# EasyEDA Pro project CH32V307_V5.0.0.eprj, board CH32V307
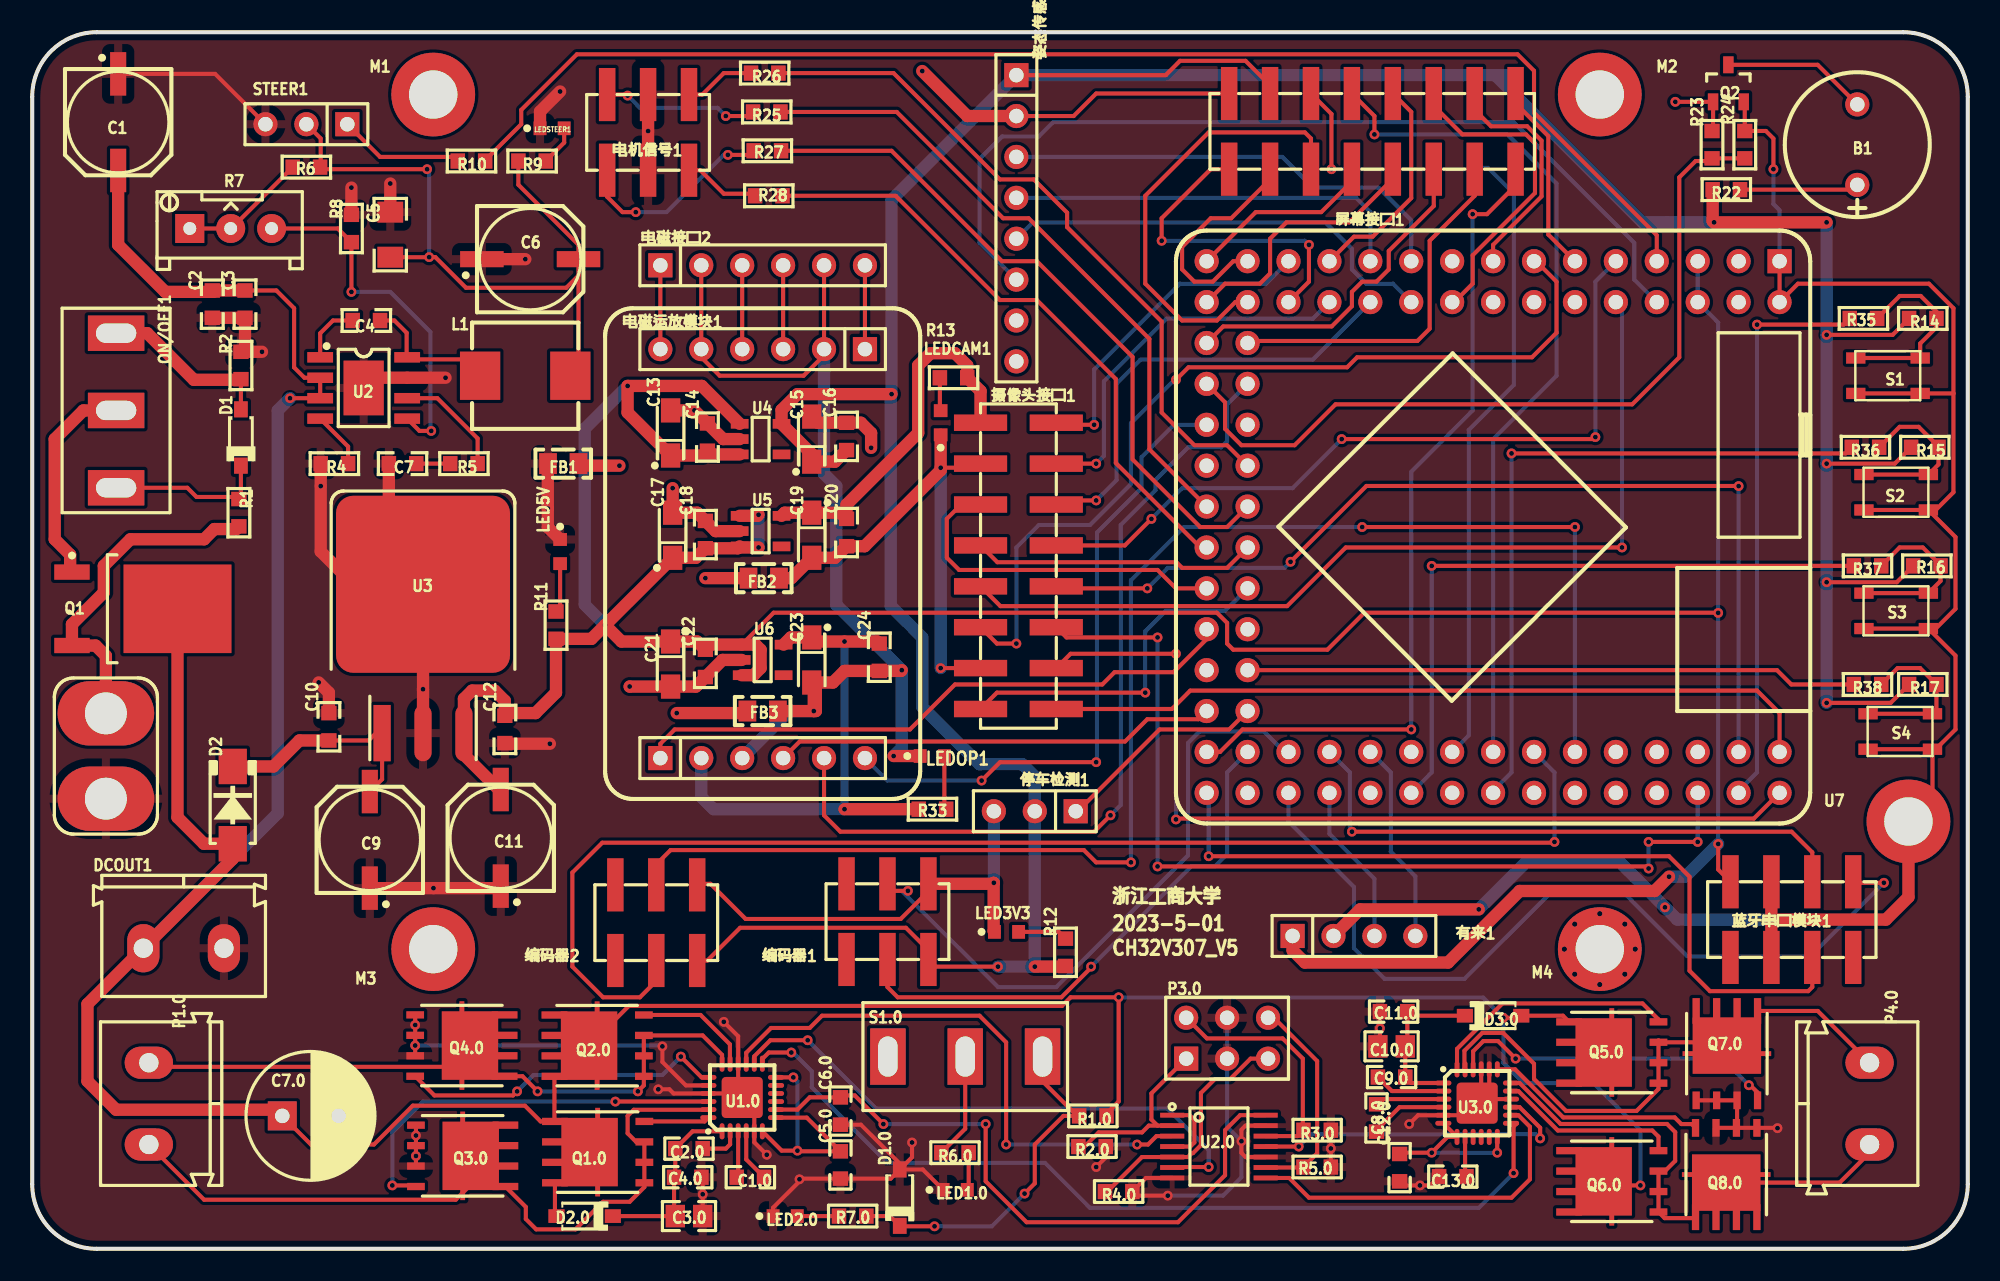
[diagram p1: board, top side]
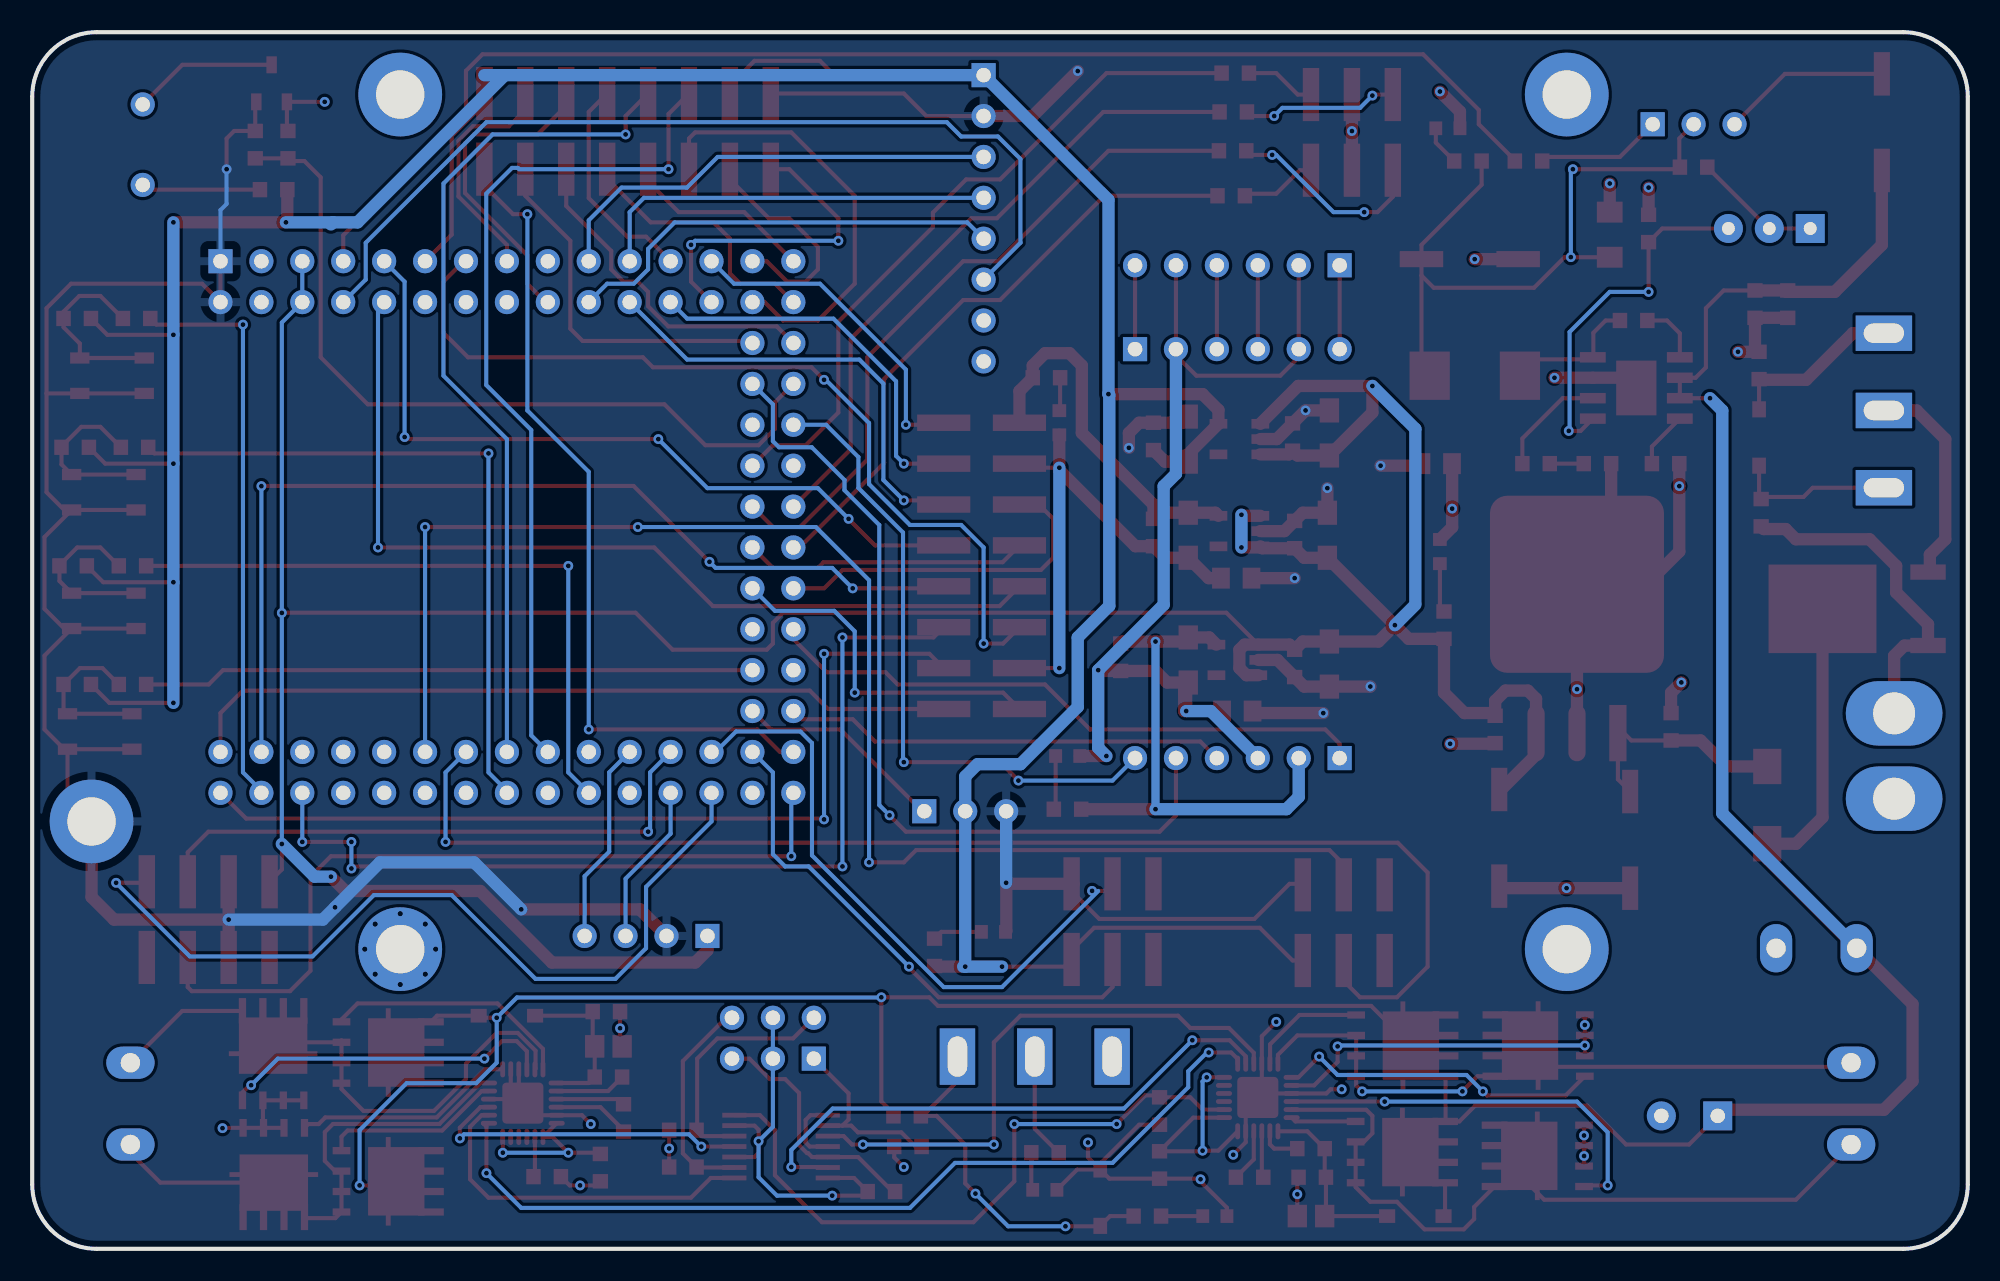
[diagram p2: board, bottom side, seen from below]

Outline 120.14 x 75.56 mm; copper layers: Top Layer, Bottom Layer. Coordinates in mm from the lower left corner of the outline.
Outline path: 0,71.56 0,4 arc(1.17,1.17) 4,0 116.14,0 arc(118.97,1.17) 120.14,4 120.14,71.56 arc(118.97,74.39) 116.14,75.56 4,75.56 arc(1.17,74.39) 0,71.56
Stack: Top Layer 0.035mm / Dielectric1 1.51mm FR4 er 4.5 / Bottom Layer 0.035mm

## Design rules (mm)
spacing safeClearance (default): track to track 0.152, other pairs 0.152 to 0.3
track width trackWidth (default): min 0.127, default 0.254, max 2.54
differential pair differentialPair (default): width min 0.127, default 0.254, max 2.54; gap min 0.152, default 0.152
via viaSize (default): diameter min 0.5, default 0.61, max 10; hole min 0.3, default 0.305, max 6

## Placement (name value [footprint] x y rotation side)
B1  BEEP  [BEEP 9x5.5mm]  113.28 68.58 90 top
C1  220uF  [CAPS6.3]  5.33 69.98 90 top
C1.0  100nF  [CAPC1608[0603]S-N]  44.58 4.44 180 top
C2  4.7nF  [CAPC1608[0603]S-N]  11.18 58.67 270 top
C2.0  1uF  [CAPC1608[0603]S-N]  40.77 6.22 180 top
C3  100nF  [CAPC1608[0603]S-N]  13.21 58.67 270 top
C3.0  10uF  [CAPC2012[0805]S-N]  40.77 2.03 0 top
C4  100nF  [CAPC1608[0603]S-N]  20.74 57.66 0 top
C4.0  100nF  [CAPC1608[0603]S-N]  40.69 4.44 0 top
C5  47uF  [CAPC3216[1206]S]  22.22 62.99 90 top
C5.0  1uF  [CAPC1608[0603]S-N]  50.17 5.21 90 top
C6  220uF  [CAPS6.3]  30.91 61.47 180 top
C6.0  1uF  [CAPC1608[0603]S-N]  50.17 8.56 90 top
C7  4.7nF  [CAPC1608[0603]S-N]  22.99 48.77 180 top
C7.0  220uF  [CAPPR3.5-8X11.5]  17.27 8.25 0 top
C8.0  100nF  [CAPC1608[0603]S-N]  83.44 8.13 90 top
C9  100uF  [CAPS6.3]  20.95 25.4 270 top
C9.0  1uF  [CAPC1608[0603]S-N]  84.38 10.67 0 top
C10  100nF  [CAPC1608[0603]S-N]  18.41 32.42 90 top
C10.0  10uF  [CAPC2012[0805]S-N]  84.38 12.57 180 top
C11  220uF  [CAPS6.3]  29.08 25.53 270 top
C11.0  100nF  [CAPC1608[0603]S-N]  84.5 14.73 180 top
C12  100nF  [CAPC1608[0603]S-N]  29.34 32.26 270 top
C12.0  1uF  [CAPC1608[0603]S-N]  84.87 5.04 90 top
C13  10uF  [CAPT3216]  39.62 50.67 90 top
C13.0  1uF  [CAPC1608[0603]S-N]  88.18 4.48 0 top
C14  100nF  [CAPC1608[0603]S-N]  41.91 50.42 90 top
C15  10uF  [CAPT3216]  48.39 50.29 90 top
C16  100nF  [CAPC1608[0603]S-N]  50.55 50.46 90 top
C17  10uF  [CAPT3216]  39.75 44.32 90 top
C18  100nF  [CAPC1608[0603]S-N]  41.78 44.36 90 top
C19  10uF  [CAPT3216]  48.39 44.32 270 top
C20  100nF  [CAPC1608[0603]S-N]  50.55 44.49 270 top
C21  10uF  [CAPT3216]  39.62 36.32 270 top
C22  100nF  [CAPC1608[0603]S-N]  41.78 36.36 270 top
C23  10uF  [CAPT3216]  48.39 36.57 270 top
C24  100nF  [CAPC1608[0603]S-N]  52.58 36.74 270 top
D1  BZT52C16  [SOD-123-L]  12.95 50.39 270 top
D1.0  BZT52C3V3  [SOD-123-L]  53.85 3.18 270 top
D2  SS54  [SMA[DO-214AC]]  12.45 27.56 90 top
D2.0  1N5819  [SOD-123-L]  34.29 2.03 0 top
D3.0  1N5819  [SOD-123-L]  90.68 14.48 180 top
DCOUT1  KF/WJ/DG 30x connecter  [KF/WJ/DG 301-2p-5.0mm#2]  9.4 18.67 0 top
FB1  0R  [INDC2012[0805]S]  32.96 48.77 0 top
FB2  0R  [INDC2012[0805]S]  45.41 41.66 0 top
FB3  0R  [INDC2012[0805]S]  45.34 33.4 0 top
L1  4.7uH  [0630 TPC 7*7*3]  30.6 54.23 0 top
LED1.0  Blue  [LEDC1608(0603)]  57.29 3.66 0 top
LED2.0  RED  [LEDC1608(0603)]  46.74 2.03 0 top
LED3V3  翠绿贴片LED  [LEDC1608(0603)]  60.48 19.69 0 top
LED5V  翠绿贴片LED  [LEDC1608(0603)]  32.77 43.31 270 top
LEDCAM1  翠绿贴片LED  [LEDC1608(0603)]  56.39 51.31 90 top
LEDOP1  翠绿贴片LED  [LEDC1608(0603)]  55.87 30.61 0 top
LEDSTEER1  翠绿贴片LED  [LEDC1608(0603)]  32.27 69.6 0 top
M1  MountHole  [M3-MountHole-Plated]  24.89 71.69 0 top
M2  MountHole  [M3-MountHole-Plated]  97.3 71.69 0 top
M3  MountHole  [M3-MountHole-Plated]  24.89 18.61 0 top
M4  MountHole  [M3-MountHole-Plated]  97.3 18.61 0 top
NOREF  -  [Pad_e1205]  116.46 26.54 0 top
ON/OFF1  SW-SPDT  [SS12D10]  5.21 52.07 90 top
P1.0  KF/WJ/DG 30x connecter  [KF/WJ/DG 301-2p-5.0mm]  7.24 9.02 270 top
P3.0  Header 3X2  [HDR2X3]  71.63 11.81 0 top
P4.0  KF/WJ/DG 30x connecter  [KF/WJ/DG 301-2p-5.0mm]  114.05 9.02 90 top
Q1  HY19P03  [TO-252AA]  5.74 39.75 0 top
Q1.0  TPH1R403NL  [DFN5x6]  35.1 6.01 90 top
Q2  S8050  [SOT-23]  105.28 72.39 90 top
Q2.0  TPH1R403NL  [DFN5x6]  35.06 12.62 90 top
Q3.0  TPH1R403NL  [DFN5x6]  26.72 5.77 270 top
Q4.0  TPH1R403NL  [DFN5x6]  26.67 12.62 270 top
Q5.0  TPH1R403NL  [DFN5x6]  98.04 12.19 90 top
Q6.0  TPH1R403NL  [DFN5x6]  98.04 4.19 90 top
Q7.0  TPH1R403NL  [DFN5x6]  105.19 12.12 0 top
Q8.0  TPH1R403NL  [DFN5x6]  105.15 4.61 180 top
R1  4.7K  [RESC1608[0603]S-N]  12.83 45.72 90 top
R1.0  2.2K  [RESC1608[0603]S-N]  65.83 8.25 180 top
R2  1K  [RESC1608[0603]S-N]  12.95 54.86 270 top
R2.0  10K  [RESC1608[0603]S-N]  65.79 6.35 0 top
R3.0  10K  [RESC1608[0603]S-N]  79.76 7.37 180 top
R4  200K  [RESC1608[0603]S-N]  18.76 48.77 180 top
R4.0  10K  [RESC1608[0603]S-N]  67.44 3.56 0 top
R5  20K  [RESC1608[0603]S-N]  26.8 48.77 180 top
R5.0  10K  [RESC1608[0603]S-N]  79.76 5.08 180 top
R6  15K  [RESC1608[0603]S-N]  17.02 67.18 180 top
R6.0  330R  [RESC1608[0603]S-N]  57.28 5.97 0 top
R7  10K  [RESPOT3296]  12.32 63.37 0 top
R7.0  1K  [RESC1608[0603]S-N]  50.93 2.03 180 top
R8  3.3K  [RESC1608[0603]S-N]  19.81 63.37 90 top
R9  10K  [RESC1608[0603]S-N]  31.03 67.56 180 top
R10  1K  [RESC1608[0603]S-N]  27.27 67.56 0 top
R11  4.7K  [RESC1608[0603]S-N]  32.51 38.73 90 top
R12  2.7K  [RESC1608[0603]S-N]  64.14 18.41 90 top
R13  2.7K  [RESC1608[0603]S-N]  57.19 54.1 180 top
R14  4.7K(DNP)  [RESC1608[0603]S-N]  117.35 57.78 0 top
R15  4.7K(DNP)  [RESC1608[0603]S-N]  117.48 49.78 0 top
R16  4.7K(DNP)  [RESC1608[0603]S-N]  117.6 42.42 0 top
R17  4.7K(DNP)  [RESC1608[0603]S-N]  117.35 35.05 0 top
R22  10R  [RESC1608[0603]S-N]  105.16 65.79 0 top
R23  4.7K  [RESC1608[0603]S-N]  104.27 68.58 90 top
R24  10K  [RESC1608[0603]S-N]  106.3 68.58 90 top
R25  100R  [RESC1608[0603]S-N]  45.59 70.61 0 top
R26  100R  [RESC1608[0603]S-N]  45.47 73.02 0 top
R27  100R  [RESC1608[0603]S-N]  45.63 68.2 0 top
R28  100R  [RESC1608[0603]S-N]  45.72 65.41 0 top
R33  2.7K  [RESC1608[0603]S-N]  55.88 27.3 0 top
R35  470R  [RESC1608[0603]S-N]  113.67 57.78 180 top
R36  470R  [RESC1608[0603]S-N]  113.79 49.78 180 top
R37  470R  [RESC1608[0603]S-N]  113.92 42.42 180 top
R38  470R  [RESC1608[0603]S-N]  113.92 35.05 180 top
S1  Button  [PTS810-3*4-CurvePin]  115.19 54.23 0 top
S1.0  SW-SPDT  [SS12D10]  57.91 11.94 0 top
S2  Button  [PTS810-3*4-CurvePin]  115.7 46.99 0 top
S3  Button  [PTS810-3*4-CurvePin]  115.7 39.62 0 top
S4  Button  [PTS810-3*4-CurvePin]  115.95 32.13 0 top
STEER1  Header 3  [HDR1X3]  19.56 69.85 180 top
U1  T型插头  [Wired T-Header ThroughHole]  4.57 30.61 0 top
U1.0  DRV8701E  [QFN24-4x4]  44.07 9.4 90 top
U2  SCT2450  [SOP-8E]  20.57 53.47 0 top
U2.0  SN74HC125PWR  [TSSOP-14]  73.66 6.35 0 top
U3  SPX2940-5.0  [TO-263-3]  24.26 36.65 0 top
U3.0  DRV8701E  [QFN24-4x4]  89.69 9.05 0 top
U4  RT9013-33  [SOT-23-5]  45.21 50.29 0 top
U5  RT9013-33  [SOT-23-5]  45.21 44.58 0 top
U6  RT9013-33  [SOT-23-5]  45.34 36.58 0 top
U7  -  [CH32V307VxT6_CoreBoard]  108.46 61.34 180 top
停车检测1  Header 3  [HDR1X3]  64.77 27.18 180 top
姿态传感器1  Header 8  [HDR1X8]  61.09 72.9 270 top
屏幕接口1  Header 8X2  [HDR2X8-M-SMT]  83.18 69.41 0 top
摄像头接口1  Header 8X2  [HDR2X8-M-SMT]  61.21 42.42 90 top
有来1  Header 4  [HDR1X4]  78.23 19.43 0 top
电机信号1  Header 3X2  [HDR2X3-M-SMT]  38.23 69.34 180 top
电磁接口2  Header 6  [HDR1X6]  38.99 61.09 0 top
电磁运放模块1  OPA_MOD  [SEEKFREE_4CHANEL_OPAMOD]  45.34 43.18 0 top
编码器1  Header 3X2  [HDR2X3-M-SMT]  53.09 20.32 180 top
编码器2  Header 3X2  [HDR2X3-M-SMT]  38.73 20.26 180 top
蓝牙串口模块1  Header 4X2  [Female-Header-2.54-SMD-8]  109.22 20.45 270 top

## Footprints (pads in the part's own frame, mm; a bottom-side part is the same pattern mirrored in y, then rotated)
0630 TPC 7*7*3
  rect 2.5x3 smd: 1(-2.8,0) 2(2.8,0)
BEEP 9x5.5mm
  round 1.5 hole 0.9: 1(-2.5,0) 2(2.5,0)
CAPC1608[0603]S-N
  rect 0.9x0.95 smd: 1(-0.85,0) 2(0.85,0)
CAPC2012[0805]S-N
  rect 1.2x1.4 smd: 1(-0.85,0) 2(0.85,0)
CAPC3216[1206]S
  rect 1.3x1.6 smd: 1(-1.4,0) 2(1.4,0)
CAPPR3.5-8X11.5
  rect 1.8x1.8 hole 0.9: 1(-1.75,0)
  round 1.8 hole 0.9: 2(1.75,0)
CAPS6.3
  rect 2.7x1 smd: 1(-3,0) 2(3,0)
CAPT3216
  rect 1.5x1.2 smd: 1(-1.4,0) 2(1.4,0)
CH32V307VxT6_CoreBoard
  rect 1.5x1.5 hole 0.9: 1(0,0)
  round 1.5 hole 0.9: 2(0,2.54) 3(2.54,0) 4(2.54,2.54) 5(5.08,0) 6(5.08,2.54) 7(7.62,0) 8(7.62,2.54) 9(10.16,0) 10(10.16,2.54) 11(12.7,0) 12(12.7,2.54) 13(15.24,0) 14(15.24,2.54) 15(17.78,0) 16(17.78,2.54) 17(20.32,0) 18(20.32,2.54) 19(22.86,0) 20(22.86,2.54) 21(25.4,0) 22(25.4,2.54) 23(27.94,0) 24(27.94,2.54) 25(30.48,0) 26(30.48,2.54) 27(33.02,0) 28(33.02,2.54) 29(35.56,0) 30(35.56,2.54) 31(35.56,5.08) 32(33.02,5.08) 33(35.56,7.62) 34(33.02,7.62) 35(35.56,10.16) 36(33.02,10.16) 37(35.56,12.7) 38(33.02,12.7) 39(35.56,15.24) 40(33.02,15.24) 41(35.56,17.78) 42(33.02,17.78) 43(35.56,20.32) 44(33.02,20.32) 45(35.56,22.86) 46(33.02,22.86) 47(35.56,25.4) 48(33.02,25.4) 49(35.56,27.94) 50(33.02,27.94) 51(35.56,33.02) 52(35.56,30.48) 53(33.02,33.02) 54(33.02,30.48) 55(30.48,33.02) 56(30.48,30.48) 57(27.94,33.02) 58(27.94,30.48) 59(25.4,33.02) 60(25.4,30.48) 61(22.86,33.02) 62(22.86,30.48) 63(20.32,33.02) 64(20.32,30.48) 65(17.78,33.02) 66(17.78,30.48) 67(15.24,33.02) 68(15.24,30.48) 69(12.7,33.02) 70(12.7,30.48) 71(10.16,33.02) 72(10.16,30.48) 73(7.62,33.02) 74(7.62,30.48) 75(5.08,33.02) 76(5.08,30.48) 77(2.54,33.02) 78(2.54,30.48) 79(0,33.02) 80(0,30.48)
DFN5x6
  rect 0.45x1.6 smd: 1(-1.905,2.65) 1(-0.635,2.65) 1(0.635,2.65) 1(1.905,2.65)
  rect 4.25x3.5 smd: 1(0,0.5)
  rect 5.5x0.3 smd: 1(0,0)
  rect 0.45x1.1 smd: 2(1.905,-2.9) 3(-1.905,-2.9) 3(-0.635,-2.9) 3(0.635,-2.9)
Female-Header-2.54-SMD-8
  rect 3.3x1.02 smd: 1(-2.35,3.81) 2(2.35,3.81) 3(-2.35,1.27) 4(2.35,1.27) 5(-2.35,-1.27) 6(2.35,-1.27) 7(-2.35,-3.81) 8(2.35,-3.81)
HDR1X3
  rect 1.5x1.5 hole 0.9: 1(0,0)
  round 1.5 hole 0.9: 2(2.54,0) 3(5.08,0)
HDR1X4
  rect 1.5x1.5 hole 0.9: 1(0,0)
  round 1.5 hole 0.9: 2(2.54,0) 3(5.08,0) 4(7.62,0)
HDR1X6
  rect 1.5x1.5 hole 0.9: 1(0,0)
  round 1.5 hole 0.9: 2(2.54,0) 3(5.08,0) 4(7.62,0) 5(10.16,0) 6(12.7,0)
HDR1X8
  rect 1.5x1.5 hole 0.9: 1(0,0)
  round 1.5 hole 0.9: 2(2.54,0) 3(5.08,0) 4(7.62,0) 5(10.16,0) 6(12.7,0) 7(15.24,0) 8(17.78,0)
HDR2X3
  rect 1.5x1.5 hole 0.9: 1(0,0)
  round 1.5 hole 0.9: 2(0,2.54) 3(2.54,0) 4(2.54,2.54) 5(5.08,0) 6(5.08,2.54)
HDR2X3-M-SMT
  rect 1.02x3.3 smd: 1(-2.54,-2.35) 2(-2.54,2.35) 3(0,-2.35) 4(0,2.35) 5(2.54,-2.35) 6(2.54,2.35)
HDR2X8-M-SMT
  rect 1.02x3.3 smd: 1(-8.89,-2.35) 2(-8.89,2.35) 3(-6.35,-2.35) 4(-6.35,2.35) 5(-3.81,-2.35) 6(-3.81,2.35) 7(-1.27,-2.35) 8(-1.27,2.35) 9(1.27,-2.35) 10(1.27,2.35) 11(3.81,-2.35) 12(3.81,2.35) 13(6.35,-2.35) 14(6.35,2.35) 15(8.89,-2.35) 16(8.89,2.35)
INDC2012[0805]S
  rect 1.1x1.3 smd: 1(-0.948,0) 2(0.948,0)
KF/WJ/DG 301-2p-5.0mm
  oval 2x3 hole 1.2: 1(2.54,0) 2(-2.54,0)
KF/WJ/DG 301-2p-5.0mm#2
  oval 2x3 hole 1.2: 1(2.5,0) 2(-2.5,0)
LEDC1608(0603)
  rect 0.8x0.85 smd: A(0.75,0) C(-0.75,0)
M3-MountHole-Plated
  round 5.2 hole 3: 1(0,0)
Pad_e1205
  round 5.2 hole 3: 1(0,0)
PTS810-3*4-CurvePin
  rect 1.2x0.7 smd: 1(-2,-1.1) 1(2,-1.1) 2(-2,1.1) 2(2,1.1)
QFN24-4x4
  rrect 2.55x2.55 smd: 0(0,0)
  oval 1x0.3 smd: 1(-2.1,1.25) 2(-2.1,0.75) 3(-2.1,0.25) 4(-2.1,-0.25) 5(-2.1,-0.75) 6(-2.1,-1.25) 13(2.1,-1.25) 14(2.1,-0.75) 15(2.1,-0.25) 16(2.1,0.25) 17(2.1,0.75) 18(2.1,1.25)
  oval 0.3x1 smd: 7(-1.25,-2.1) 8(-0.75,-2.1) 9(-0.25,-2.1) 10(0.25,-2.1) 11(0.75,-2.1) 12(1.25,-2.1) 19(1.25,2.1) 20(0.75,2.1) 21(0.25,2.1) 22(-0.25,2.1) 23(-0.75,2.1) 24(-1.25,2.1)
RESC1608[0603]S-N
  rect 0.9x0.95 smd: 1(-0.85,0) 2(0.85,0)
RESPOT3296
  rect 1.8x1.8 hole 0.8: 1(-2.54,0)
  round 1.8 hole 0.8: 2(2.54,0) ADJ(0,0)
SEEKFREE_4CHANEL_OPAMOD
  rect 1.5x1.5 hole 0.9: 1(6.35,12.7) 7(-6.35,-12.7)
  round 1.5 hole 0.9: 2(3.81,12.7) 3(1.27,12.7) 4(-1.27,12.7) 5(-3.81,12.7) 6(-6.35,12.7) 8(-3.81,-12.7) 9(-1.27,-12.7) 10(1.27,-12.7) 11(3.81,-12.7) 12(6.35,-12.7)
SMA[DO-214AC]
  rect 2.2x1.75 smd: A(-2.4,0) K(2.4,0)
SOD-123-L
  rect 1x0.85 smd: A(-1.75,0) K(1.75,0)
SOP-8E
  rect 2.5x3.4 smd: 0(0,0)
  rect 1.6x0.65 smd: 1(-2.7,1.905) 2(-2.7,0.635) 3(-2.7,-0.635) 4(-2.7,-1.905) 5(2.7,-1.905) 6(2.7,-0.635) 7(2.7,0.635) 8(2.7,1.905)
SOT-23
  rect 1.05x0.65 smd: 1(-1.15,0.95) 2(-1.15,-0.95) 3(1.15,0)
SOT-23-5
  rect 1.1x0.6 smd: 1(-1.3,0.95) 2(-1.3,0) 3(-1.3,-0.95) 4(1.3,-0.95) 5(1.3,0.95)
SS12D10
  rect 2.2x3.5 hole 1.2x2.5: 1(-4.8,0) 2(0,0) 3(4.8,0)
TO-252AA
  rect 6.7x5.5 smd: 1(3.275,0)
  rect 2.2x0.95 smd: 2(-3.275,2.28) 3(-3.275,-2.28)
TO-263-3
  rect 1.07x3.5 smd: 1(-2.54,-4.623)
  rrect 10.8x11 smd: 2(0,4.623)
  rrect 1.07x3.5 smd: 2(0,-4.623) 3(2.54,-4.623)
TSSOP-14
  rect 1.5x0.3 smd: 1(-2.9,1.95) 2(-2.9,1.3) 3(-2.9,0.65) 4(-2.9,0) 5(-2.9,-0.65) 6(-2.9,-1.3) 7(-2.9,-1.95) 8(2.9,-1.95) 9(2.9,-1.3) 10(2.9,-0.65) 11(2.9,0) 12(2.9,0.65) 13(2.9,1.3) 14(2.9,1.95)
Wired T-Header ThroughHole
  rrect 6x4 hole 2.6: 1(0,2.65) 2(0,-2.65)

## Nets
As in the schematic, except:
GND5V: C13.2 C14.2 C15.2 C16.2 C17.2 C18.2 C21.2 C22.2 FB1.2 FB2.1 FB3.1 LED3V3.C NOREF.1 Q2.2 R24.2 S1.1 S2.1 S3.1 S4.1 U4.2 U5.2 U6.2 U7.1 U7.2 停车检测1.3 姿态传感器1.2 屏幕接口1.2 有来1.2 编码器1.1 编码器2.1 蓝牙串口模块1.5 蓝牙串口模块1.6

Pads without a net: M1 1; M2 1; M3 1; M4 1; S1.0 1; U1.0 9 10 11; U3.0 9 10 11; U4 4; U5 4; U6 4; U7 3 4 12 14 16 17 36 37 46 47 53 59 62 63 67 69 71 72 73 74 76; 姿态传感器1 7 8; 编码器1 5 6; 编码器2 5 6; 蓝牙串口模块1 2 8

## Via types
v1: diameter 0.61, hole 0.305, Top Layer to Bottom Layer, 162 vias

## Routing (per net, layer and track width the routed paths; a pad name or vN(x,y) marks a point on that pad's centre or on a via; arc(x,y) is an arc through that point)
3V3: length 22.2
  Top Layer w0.254: R1.0.2 64.86,8.25 ; 64.86,8.25 62.71,10.4 S1.0.3 ; 64.86,8.25 64.01,8.25 62.23,6.48 62.23,4.06 v1(61.59,3.43) ; v1(56.01,1.4) 53.88,1.4 D1.0.K 53.24,2.03 51.83,2.03
  Bottom Layer w0.254: v1(61.59,3.43) 59.56,1.4 v1(56.01,1.4)
DVDD: length 40.5
  Top Layer w0.254: 49.88,9.41 48.26,9.41 47.5,8.65 U1.0.8 ; 49.88,9.41 C6.0.2 50.28,9.53 51.05,9.53 v1(52.83,7.75) ; 49.88,9.41 49.89,9.4 ; U2.0.14 74.98,8.3 74.04,7.37 74.04,4.57 71.12,1.65 61.72,1.65 59.18,4.19 v1(59.18,7.75)
  Bottom Layer w0.254: v1(59.18,7.75) v1(52.83,7.75)
GND5V: length 212.1
  Top Layer w0.254: Q2.2 106.3,71.17 R24.2 107.61,69.43 108.08,68.96 v1(108.08,67.06) ; S3.1 S3.1 ; S3.1 119.38,36.84 119.38,32.26 118.15,31.03 S4.1 ; S3.1 118.15,38.52 119.38,39.75 119.38,44.21 S2.1 ; 119.25,53.13 119.25,58.42 117.73,59.94 109.6,59.94 U7.2 U7.1 ; 119.25,53.13 119.25,46.99 118.15,45.89 S2.1 ; 119.25,53.13 S1.1 S1.1 ; S2.1 S2.1 ; S4.1 S4.1 ; S4.1 117.95,28.03 NOREF.1 ; 编码器1.1 55.63,22.21 53.91,20.49 44.28,20.49 42.1,22.67 41.34,22.67 编码器2.1 ; 屏幕接口1.2 66.04,71.76 64.64,70.36 姿态传感器1.2
  Top Layer w0.762: 蓝牙串口模块1.6 v1(107.95,20.45) ; v1(107.95,20.45) 115.06,20.45 116.46,21.84 NOREF.1 ; v1(107.95,20.45) 蓝牙串口模块1.5 ; 44.04,36.58 42.85,36.58 C22.2 41.19,34.92 C21.2 37.09,34.92 v1(37.08,34.92) ; v1(52.07,49.75) 52.07,50.67 51.43,51.31 C16.2 48.77,51.31 48.39,51.69 ; v1(55.24,73.15) 58.04,70.36 姿态传感器1.2 ; 39.62,52.07 v1(41.11,52.07) C14.2 42.89,50.29 U4.2 ; v1(41.78,41.66) FB2.1 ; v1(36.45,48.64) 34.04,48.64 33.91,48.77 ; v1(89.79,21.08) 82.42,21.08 有来1.2 ; 55.5,22.67 编码器1.1 59.63,22.67 59.68,22.72 ; 59.68,22.72 59.68,19.73 LED3V3.C ; 59.68,22.72 v1(59.69,22.73) ; v1(40,33.27) 44.26,33.27 FB3.1 ; v1(39.75,47.24) C17.2 41.27,45.72 C18.2 42.42,44.58 U5.2
  Bottom Layer w0.254: U7.1 108.46,64.52 108.08,64.9 v1(108.08,67.06)
  Bottom Layer w0.762: v1(59.69,22.73) 停车检测1.3 ; v1(89.79,21.08) 92.71,24 98.55,24 v1(101.35,21.21) 102.11,20.45 v1(107.95,20.45)
GNDBAT: length 196.7
  Top Layer w0.254: U2.0.13 75.31,7.65 75.06,7.4 v1(75.06,6.68) 75.06,5.95 75.31,5.7 U2.0.10 ; v1(45.59,5.84) 44.82,6.62 U1.0.5 44.82,8.65 43.82,9.65 ; v1(38.86,9.91) 39.55,9.91 39.81,9.65 43.82,9.65 ; LED1.0.C 55.28,4.93 D1.0.A ; 108.33,7.51 Q8.0.3 Q8.0.3 ; 66.64,6.07 66.64,5.68 v1(66.04,5.08) ; 43.82,9.65 U1.0.16 43.82,13.2 v1(42.93,14.1) ; v1(70.48,3.3) 68.54,3.3 R4.0.2 69.13,4.4 U2.0.7 ; v1(54.61,6.6) 54.61,5.69 D1.0.A ; C1.2 11.35,72.98 STEER1.3 ; C11.0.2 v1(83.65,13.7) 83.65,12.7 83.78,12.57 ; v1(23.77,12.63) Q4.0.3 ; 23.77,13.39 23.77,12.88 ; 105.82,9.09 105.82,7.55 Q8.0.3 ; Q3.0.3 v1(23.82,7.04) Q3.0.3 v1(23.82,5.76) Q3.0.3 ; R3.0.1 v1(80.61,6.23) R5.0.1 ; v1(39.12,12.57) 39.12,11.6 40.57,10.15 41.97,10.15 ; C6.0.1 51.43,7.71 53.85,5.29 D1.0.A ; Q7.0.3 Q7.0.3 Q7.0.3 ; D1.0.A 53.28,4.36 C5.0.1 47.66,4.36 v1(47.62,4.32) 47.62,4.19 45.99,2.55 LED2.0.C ; Q8.0.3 Q8.0.3 ; 89.94,9.3 U3.0.0 88.94,8.3 86.02,8.3 v1(85.47,7.75) ; 89.94,9.3 U3.0.16 ; 89.94,9.3 90.44,9.8 U3.0.20 ; 89.94,9.3 U3.0.21 ; Q4.0.3 v1(23.77,13.9) 23.77,13.51 ; C3.0.2 v1(41.62,3.39) 41.62,4.37 41.54,4.44 ; C13.0.1 86.78,3.94 v1(86.14,3.94) 84.87,3.94
  Top Layer w0.762: U3.2 v1(24.26,34.76) U3.2 ; U3.2 22.14,43.39 C7.2 ; U3.2 19.94,41.27 17.91,43.31 v1(17.91,47.37) R4.2 ; v1(17.78,35.18) 18.41,34.54 C10.2 ; R8.2 v1(19.81,65.91) ; 电机信号1.4 v1(38.23,69.42) 电机信号1.3 ; C12.2 29.38,31.37 v1(32.13,31.37) ; 13.14,55.71 13.21,55.78 C3.2 C2.2 ; 13.14,55.71 v1(14.26,55.71) ; 13.14,55.71 R2.1 ; LEDSTEER1.C 31.52,70.64 v1(32.77,71.88) ; U2.0 21.21,54.1 U2.7 v1(25.65,54.1) ; C9.2 v1(24.91,22.4) 29.08,22.4 ; v1(30.61,61.47) C6.2 ; FB1.1 32,48.76 v1(32,45.97) 32,44.82 LED5V.C ; v1(22.22,66.17) 22.22,64.39
  Bottom Layer w0.254: P3.0.4 P3.0.3 74.17,7.57 v1(75.06,6.68) 75.06,4.44 73.91,3.3 v1(70.48,3.3) ; v1(23.77,12.63) 39.06,12.63 v1(39.12,12.57)
  vias: v1(108.33,7.49)
GNDCAM: length 32.5
  Top Layer w0.254: 摄像头接口1.14 58.61,48.51 v1(56.39,48.51) ; v1(56.39,36.07) 摄像头接口1.4
  Top Layer w0.762: LEDCAM1.C v1(56.39,48.51) 56.39,48.36 51.67,43.64 C20.2 49.83,42.92 C19.2 47.12,41.66 46.36,41.66
  Bottom Layer w0.762: v1(56.39,48.51) v1(56.39,36.07)
GNDOP: length 66.5
  Top Layer w0.254: 电磁接口2.2 41.53,55.37 42.67,54.23 47.88,54.23 49.02,55.37 49.15,55.37 电磁接口2.5
  Top Layer w0.762: 48.64,34.92 C23.2 49.7,35.17 50.42,35.89 C24.2 53.93,35.89 v1(53.98,35.94) ; 48.64,34.92 48.64,33.4 v1(48.51,33.4) ; 48.64,34.92 48.51,34.79 v1(48.51,33.4) ; v1(53.47,30.61) LEDOP1.C ; v1(48.51,33.4) FB3.2
  Bottom Layer w0.762: 电磁运放模块1.2 49.15,48.13 49.91,47.37 49.91,40 v1(53.98,35.94) 53.98,31.11 v1(53.47,30.61) ; v1(48.51,33.4) 46.99,33.4 电磁运放模块1.9
VCC3V3: length 229.8
  Top Layer w0.254: v1(111.38,33.91) 115.36,33.91 R17.1 ; R14.1 115.48,56.77 v1(111.38,56.77) ; 姿态传感器1.1 70.36,72.9 71.25,73.79 75.31,73.79 76.83,72.26 屏幕接口1.4 ; v1(59.94,17.53) 56.07,17.53 编码器1.2 55.63,18.54 54.23,19.94 43.94,19.94 41.91,17.91 41.28,17.91 ; 116.62,49.78 115.61,48.77 v1(111.38,48.77) ; R16.1 115.74,41.4 v1(111.38,41.4)
  Top Layer w0.762: C16.1 49.83,48.89 C15.1 48.39,49.37 U4.5 46.51,52.1 47.5,53.09 v1(53.34,53.09) ; v1(62.23,17.53) 64.1,17.53 R12.1 ; v1(111.38,63.75) v1(104.39,63.75) 104.31,63.84 R22.1
  Bottom Layer w0.762: v1(62.23,17.53) 停车检测1.2 62.23,29.34 61.47,30.1 58.8,30.1 55.24,33.66 55.24,37.97 53.29,39.93 53.29,53.03 v1(53.34,53.09) 53.34,65.15 姿态传感器1.1 92.08,72.9 ; v1(62.23,17.53) 62.36,17.53 ; v1(62.23,17.53) v1(59.94,17.53) ; v1(104.39,63.75) 101.47,63.75 ; 101.47,63.75 99.95,63.75 90.93,72.77 ; 101.47,63.75 101.6,63.63 ; v1(111.38,63.75) v1(111.38,56.77) v1(111.38,48.77) v1(111.38,41.4) v1(111.38,33.91)
VCC5V: length 217.4
  Top Layer w0.254: 蓝牙串口模块1.7 104.65,23.56 v1(104.65,25.15) ; v1(104.65,39.5) 104.63,39.51 82.69,39.51 80.39,37.21 74.55,37.21 74.17,37.59 74.17,38.88 73.53,39.51 46.02,39.51 44.04,37.53
  Top Layer w0.762: v1(101.6,23.11) 100.71,22.22 92.33,22.22 87.88,17.78 78.99,17.78 78.23,18.54 有来1.1 ; v1(45.08,45.59) 45.02,45.53 U5.1 ; 43.85,43.56 43.8,43.51 C18.1 41.19,42.92 C17.1 v1(35.56,38.73) ; 43.85,43.56 U5.3 ; 43.85,43.56 v1(45.08,43.56) ; v1(35.56,38.73) 34.71,37.89 R11.1 32.51,34.54 31.24,33.27 29.5,33.27 C12.1 29.34,34.04 28.7,34.67 27.3,34.67 26.8,34.16 U3.3 26.8,30.69 29.08,28.4 ; v1(35.56,38.73) 36.58,37.72 C21.1 41.27,37.72 C22.1 42.1,37.53 44.89,37.53 45.21,37.21 45.21,36.07 44.77,35.63 44.04,35.63 ; U4.1 41.56,53.59 v1(36.96,53.59) 36.96,51.94 C13.1 41.61,49.27 C14.1 42.14,49.34 U4.3
  Bottom Layer w0.254: U7.5 U7.6 104.65,57.53 v1(104.65,39.5) v1(104.65,25.15)
  Bottom Layer w0.762: v1(101.6,23.11) 102.62,23.11 v1(104.65,25.15) ; v1(36.96,53.59) 34.29,50.93 34.29,40.13 ; v1(45.08,45.59) v1(45.08,43.56) ; v1(35.56,38.73) 34.29,40
VCCBAT: length 225.6
  Top Layer w0.254: 32.54,2.29 32.45,2.38 Q1.0.1 ; Q6.0.1 97.8,3.94 v1(99.82,3.94) ; C7.0.1 17.3,6.48 21.21,6.48 23.62,8.89 30.58,8.89 31.56,7.91 Q1.0.1 32.41,7.94 Q2.0.1 ; C3.1 15.15,59.52 16.26,58.42 16.26,54.74 16.9,54.1 U2.2 U2.3 v1(16,52.83) ; Q5.0.1 95.01,14.48 D3.0.A 92.3,14.35 v1(91.31,14.35) ; Q2.0.1 37.03,15.09 63.92,15.09 64.46,15.62 v1(67.44,15.62) 67.44,9.15 66.68,8.4 R1.0.1
  Top Layer w0.762: C2.1 11.33,59.52 ; 11.33,59.52 11.24,59.44 8.25,59.44 5.33,62.36 C1.1 ; 11.33,59.52 C3.1 ; Q1.1 9.02,26.8 10.66,25.16 D2.A 12.45,24.22 DCOUT1.2 3.43,15.2 3.43,10.41 5.21,8.64 15.14,8.64 C7.0.1
  Bottom Layer w0.254: v1(67.44,15.62) 67.45,15.61 90.06,15.61 v1(91.31,14.35) 91.31,11.56 92.58,10.29 96.9,10.29 99.82,7.37 v1(99.82,3.94)
  Bottom Layer w0.762: DCOUT1.2 6.9,18.71 15.24,27.05 15.24,52.07 v1(16,52.83)
VCCCAM: length 23.2
  Top Layer w0.762: U5.5 46.7,45.72 C19.1 50.17,45.72 C20.1 50.55,46.23 54.99,50.67 54.99,54.86 55.75,55.63 57.28,55.63 58.04,54.86 R13.1 58.86,53.28 摄像头接口1.16
VCCOP: length 32.9
  Top Layer w0.762: C24.1 52.45,37.72 v1(50.42,37.72) 48.64,37.72 C23.1 47.09,37.97 U6.5 ; v1(50.42,27.3) R33.1
  Bottom Layer w0.508: v1(50.42,37.72) v1(50.42,27.3)
  Bottom Layer w0.762: v1(50.42,27.3) 42.29,27.3 41.53,28.07 电磁运放模块1.8
VCCSTEER: length 43.1
  Top Layer w0.254: v1(24.51,67.06) 17.99,67.06 R6.1 17.91,67.22 17.91,68.96 STEER1.2 ; C5.1 24.63,61.59 v1(24.64,61.59) 25.02,61.59 26.92,59.69 33.15,59.69 33.91,60.45 ; 33.91,60.45 C6.1 33.91,62.36 30.18,66.09 30.18,67.56 ; 33.91,60.45 33.91,54.74 L1.2
  Bottom Layer w0.254: v1(24.64,61.59) 24.64,66.93 v1(24.51,67.06)
(no net):
  vias: v1(95.1,18.61) v1(95.1,18.61) v1(95.74,20.17) v1(95.74,20.17) v1(95.74,17.06) v1(95.74,17.06) v1(97.3,20.81) v1(97.3,20.81) v1(97.3,16.41) v1(97.3,16.41) v1(98.86,20.17) v1(98.86,20.17) v1(98.86,17.06) v1(98.86,17.06) v1(99.5,18.61) v1(99.5,18.61)
A0: length 43.1
  Top Layer w0.254: U7.38 74.17,49.91 72.14,49.91 70.1,51.94 70.1,57.59 64.24,63.46 64.24,64.36 62.17,66.42 60.07,66.42 53.46,73.02 R26.2
A1: length 40.6
  Top Layer w0.254: R25.2 53.66,70.61 60.27,64.01 61.85,64.01 69.34,56.52 69.34,49.66 U7.39
A2: length 42.9
  Top Layer w0.254: U7.40 74.17,44.83 72.49,44.83 68.3,49.03 68.3,55.4 62.36,61.34 60.2,61.34 53.34,68.2 R27.2
A3: length 38.4
  Top Layer w0.254: R28.2 53.59,65.41 60.07,58.93 62.36,58.93 67.26,54.03 67.26,48.81 72.51,43.56 U7.41
A4: length 17.7
  Top Layer w0.254: U7.42 74.17,42.29 71.37,42.29 71.02,42.64 59.91,42.64 摄像头接口1.10
A5: length 21.8
  Top Layer w0.254: U7.43 70.99,41.02 69.85,42.16 57.53,42.16 56.77,42.93 56.77,45.34 57.66,46.23 摄像头接口1.12
A6: length 21.9
  Top Layer w0.254: v1(69.09,34.54) 59.88,34.54 摄像头接口1.2
  Bottom Layer w0.254: v1(69.09,34.54) 69.09,38.35 70.36,39.62 74.04,39.62 U7.44
A7: length 38.1
  Top Layer w0.254: 电磁运放模块1.7 38.99,31.37 39.88,32.26 54.48,32.26 57.28,35.05 66.42,35.05 67.18,35.81 70.84,35.81 72.9,37.87 U7.45
A8: length 35.5
  Top Layer w0.254: R35.2 112.43,57.4 v1(107.06,57.4)
  Bottom Layer w0.254: U7.77 105.92,28.45 107.06,29.59 v1(107.06,57.4)
A9: length 48.4
  Top Layer w0.254: 摄像头接口1.1 70.74,33.53 71.88,34.67 107.06,34.67 108.46,33.27 U7.80
A10: length 56.2
  Top Layer w0.254: 摄像头接口1.3 64.45,36.96 v1(70.99,36.96) ; U7.79 106.86,26.72 71.04,26.72 v1(70.99,26.67)
  Bottom Layer w0.254: v1(70.99,26.67) v1(70.99,36.96)
A15: length 83.8
  Top Layer w0.254: R10.2 28.12,67.61 30.35,69.85 30.35,70.74 33.81,74.19 92.19,74.19 93.22,73.17 93.22,70.57 100.84,62.95 U7.7
B0: length 38
  Top Layer w0.254: R38.2 109.19,35.05 108.3,35.94 U7.48
B1: length 27.5
  Top Layer w0.254: 电磁运放模块1.10 47.64,31.51 67.83,31.51 69.21,32.89 72.39,32.89 U7.49
B2: length 13.2
  Top Layer w0.254: U7.50 74.3,32.26 69.98,32.26 64.9,27.18 停车检测1.1
B3: length 28.7
  Bottom Layer w0.254: 姿态传感器1.3 77.6,67.82 79.5,65.91 83.57,65.91 85.6,63.88 U7.19
B4: length 27.7
  Bottom Layer w0.254: U7.20 84.45,59.94 82.8,59.94 81.92,60.83 81.92,62.1 80.26,63.75 62.1,63.75 姿态传感器1.5
B5: length 25.4
  Bottom Layer w0.254: 姿态传感器1.4 82.17,65.28 83.06,64.39 U7.21
B6: length 28.2
  Top Layer w0.254: 摄像头接口1.11 63.82,46.48 v1(66.04,46.48)
  Bottom Layer w0.254: v1(66.04,46.48) 67.31,47.75 67.31,53.74 68.8,55.23 79.49,55.23 U7.22
B7: length 13.7
  Top Layer w0.254: 屏幕接口1.10 85.6,70.61 85.6,65.26 83.2,62.86 82.04,62.86 U7.23
B8: length 23.8
  Top Layer w0.254: v1(66.04,48.77) 摄像头接口1.13
  Bottom Layer w0.254: v1(66.04,48.77) 66.52,49.25 66.52,53.89 70.41,57.77 79.49,57.77 U7.24
B9: length 20.7
  Top Layer w0.254: 摄像头接口1.15 63.69,51.18 v1(65.91,51.18)
  Bottom Layer w0.254: U7.25 76.58,59.94 71.25,59.94 65.91,54.61 v1(65.91,51.18)
B12: length 40.8
  Top Layer w0.254: v1(86.87,42.42) R37.2
  Bottom Layer w0.254: U7.61 86.87,29.59 v1(86.87,42.42)
B13: length 53.5
  Top Layer w0.254: v1(80.64,67.06) 80.64,70.49 屏幕接口1.6
  Bottom Layer w0.254: U7.64 89.17,31.89 89.17,50.86 91.96,53.65 91.96,65.53 90.36,67.14 90,67.14 89.92,67.06 v1(80.64,67.06)
B15: length 52.6
  Top Layer w0.254: v1(83.31,69.22) 83.31,70.36 81.92,71.76
  Bottom Layer w0.254: v1(83.31,69.22) 91.57,69.22 94.61,66.17 94.61,54.23 90.68,50.29 U7.66
C0: length 53.3
  Top Layer w0.254: v1(66.93,26.92) 65.91,25.91 50.17,25.91 49.15,26.92 电磁运放模块1.11
  Bottom Layer w0.254: U7.34 74.17,52.45 74.17,50.16 73.79,49.78 71.75,49.78 69.72,47.75 69.72,47.12 67.56,44.96 67.56,27.56 67.18,27.18
C1: length 40.4
  Top Layer w0.254: v1(58.93,29.08) 60.07,30.23 v1(66.04,30.23)
  Bottom Layer w0.254: 电磁运放模块1.12 53.09,29.08 v1(58.93,29.08) ; U7.35 70.87,51.18 68.86,49.17 68.86,47.26 66.09,44.49 66.09,30.28 v1(66.04,30.23)
C8: length 59.1
  Top Layer w0.254: v1(69.85,37.97) 64.2,37.97 摄像头接口1.5 ; v1(103.38,25.27) v1(100.33,25.27) ; v1(100.33,23.62) 100.2,23.75 v1(69.85,23.75)
  Bottom Layer w0.254: v1(103.38,25.27) U7.75 ; v1(69.85,37.97) v1(69.85,23.75) ; v1(100.33,23.62) v1(100.33,25.27)
C9: length 61.6
  Top Layer w0.254: v1(78.11,42.67) 82.81,47.38 105.91,47.38 v1(105.92,47.37) ; 摄像头接口1.7 63.69,41.02 v1(69.21,41.02)
  Bottom Layer w0.254: v1(69.21,41.02) 70.48,42.29 77.72,42.29 v1(78.11,42.67) ; v1(105.92,47.37) U7.78
C10: length 57.4
  Bottom Layer w0.254: U7.8 99.44,60.2 99.44,62.48 91.95,69.98 63.37,69.98 62.48,69.09 60.2,69.09 58.8,67.69 58.8,62.48 姿态传感器1.6
C11: length 47.7
  Top Layer w0.254: v1(69.47,45.34) 67.82,43.69 摄像头接口1.9 ; v1(81.28,50.29) 96.9,50.29 v1(97.03,50.42)
  Bottom Layer w0.254: v1(69.47,45.34) 71.37,47.24 78.23,47.24 v1(81.28,50.29) ; U7.9 97.03,60.07 v1(97.03,50.42)
C12: length 57.2
  Top Layer w0.254: v1(98.68,43.56) 81.53,43.56 77.89,39.92 60.09,39.92 摄像头接口1.8
  Bottom Layer w0.254: U7.10 98.68,58.42 v1(98.68,43.56)
C13: length 49.9
  Top Layer w0.254: U7.33 74.04,52.58 74.04,50.93 75.06,49.91 78.36,49.91 80.9,52.45 99.31,52.45 102.23,55.37 102.23,66.55 103.25,67.56 104.1,67.56 R23.1 R24.1
D0: length 11.9
  Top Layer w0.254: U7.11 94.11,62.99 94.11,69.11 92.08,71.14 92.08,71.75
D2: length 55
  Top Layer w0.254: U7.13 93.34,61.34 94.61,60.07 94.61,56.9 93.09,55.37 82.24,55.37 81.61,54.75 71.77,54.75 v1(70.99,53.97) ; 摄像头接口1.6 59.88,37.59 v1(61.09,37.59)
  Bottom Layer w0.254: v1(61.09,37.59) 61.09,43.56 62.48,44.96 65.66,44.96 68.2,47.5 68.2,51.29 70.89,53.97 v1(70.99,53.97)
D4: length 14.7
  Top Layer w0.254: 屏幕接口1.14 89.53,70.74 90.55,69.72 92.79,69.72 93.68,68.83 93.68,65.36 90.68,62.36 U7.15
D7: length 20.1
  Top Layer w0.254: U7.18 88.27,58.8 89.41,59.94 89.41,61.71 93.28,65.58 93.28,68.66 92.73,69.22 88.77,69.22 86.99,70.99 屏幕接口1.12
D8: length 42.8
  Top Layer w0.254: R36.2 112.56,49.4 v1(91.82,49.4)
  Bottom Layer w0.254: U7.65 90.68,28.45 91.82,29.59 v1(91.82,49.4)
D9: length 81.4
  Top Layer w0.254: 编码器2.4 38.73,16.64 37.72,15.62 35.43,15.62 33.53,17.53 33.53,23.37 35.38,25.22 94.44,25.22 v1(94.49,25.27)
  Bottom Layer w0.254: U7.68 94.49,29.59 v1(94.49,25.27)
D11: length 91.8
  Top Layer w0.254: 编码器2.3 38.73,23.88 39.62,24.77 65.28,24.77 66.04,24 v1(68.2,24) ; v1(95.76,44.83) v1(82.55,44.83)
  Bottom Layer w0.254: v1(82.55,44.83) 71.5,44.83 68.2,41.53 v1(68.2,24) ; v1(95.76,44.83) U7.70
E0: length 20.2
  Top Layer w0.254: U7.26 79.25,60.07 v1(79.25,62.36) ; 屏幕接口1.1 73.15,67.06 70.1,64.01 v1(70.1,62.61)
  Bottom Layer w0.254: v1(70.1,62.61) 78.99,62.61 v1(79.25,62.36)
E1: length 14.1
  Top Layer w0.254: U7.27 74.55,61.34 73.28,60.07 72.14,60.07 71.37,60.83 71.37,62.23 73.15,64.01 74.42,64.01 76.83,66.42 屏幕接口1.3
E2: length 27.2
  Top Layer w0.254: U7.28 74.68,58.8 73.53,57.66 71.37,57.66 69.09,59.94 69.09,65.41 73.02,69.34 78.99,69.34 79.37,68.96 屏幕接口1.5
E3: length 11.8
  Top Layer w0.254: 81.92,67.06 81.92,66.29 80.01,64.39 75.95,64.39 U7.29
E4: length 16.6
  Top Layer w0.254: U7.30 74.04,59.94 76.2,59.94 76.83,60.58 76.83,62.74 77.85,63.75 81.75,63.75 84.45,66.46 屏幕接口1.9
E5: length 21.1
  Top Layer w0.254: 屏幕接口1.11 86.99,64.77 84.2,61.98 84.2,60.83 83.44,60.07 82.55,60.07 81.92,59.44 81.92,58.55 80.66,57.29 73.93,57.29 U7.31
E6: length 22.7
  Top Layer w0.254: U7.32 75.56,56.39 85.98,56.39 86.74,57.15 86.74,62.61 89.53,65.41 屏幕接口1.13
E7: length 51.3
  Top Layer w0.254: v1(85.6,32.26) 75.12,32.26 73.73,30.86 U7.52 ; v1(89.41,64.26) 90.3,64.26 92.08,66.04 92.08,67.06
  Bottom Layer w0.254: v1(89.41,64.26) 89.41,52.07 85.6,48.26 v1(85.6,32.26)
E8: length 50.3
  Top Layer w0.254: v1(73.02,24.38) 101.6,24.38 102.87,23.11 102.87,17.27 104.14,16 110.24,16 110.49,16.26 蓝牙串口模块1.4
  Bottom Layer w0.254: U7.51 73.02,28.19 v1(73.02,24.38)
E9: length 33.7
  Top Layer w0.254: v1(65.72,17.53) 65.72,17.46 63.88,15.62 53.72,15.62 53.09,16.26 编码器1.4
  Bottom Layer w0.254: v1(65.72,17.53) 71.95,23.75 73.41,23.75 74.17,24.51 74.17,29.59 U7.54
E11: length 39.1
  Top Layer w0.254: 编码器1.3 53.52,22.23 v1(54.36,22.23)
  Bottom Layer w0.254: 53.98,22.22 59.94,16.26 63.56,16.26 71.74,24.43 71.74,31.41 72.46,32.13 76.45,32.13 77.72,30.86 U7.56
E12: length 52.6
  Top Layer w0.254: v1(114.93,22.73) 113.09,22.73 蓝牙串口模块1.1
  Bottom Layer w0.254: v1(114.93,22.73) 110.36,18.16 102.74,18.16 98.93,21.97 94.11,21.97 88.9,16.76 83.95,16.76 82.04,18.67 82.04,22.48 77.98,26.54 U7.55
E13: length 36.5
  Top Layer w0.254: v1(81.92,25.91) 109.21,25.91 110.49,24.62 蓝牙串口模块1.3
  Bottom Layer w0.254: v1(81.92,25.91) 81.79,26.03 81.79,29.59 U7.58
E14: length 10.6
  Bottom Layer w0.254: 80.9,27.94 U7.57 80.52,25.78 83.31,22.99 有来1.3
E15: length 12.6
  Bottom Layer w0.254: 有来1.4 85.85,23.14 84.33,24.66 84.33,29.59 U7.60
L_A: length 45.2
  Top Layer w0.254: 41.97,8.65 41.96,8.64 37.34,8.64 36.96,8.25 36.96,7.17 37.49,6.64 Q1.0.3 Q1.0.3 Q1.0.3 38,3.83 37.08,2.92 35.43,2.92 33.72,1.21 31.28,1.21 30.64,1.85 30.64,2.6 Q3.0.1 ; Q3.0.1 27.09,5.65 27.09,3.85 26.29,3.05 10.67,3.05 P1.0.1
L_B: length 38.8
  Top Layer w0.254: v1(31.37,9.78) 30.43,10.72 Q4.0.1 ; U1.0.18 42.82,12.04 41.61,13.25 Q2.0.3 Q2.0.3 Q2.0.3 37.96,10.15 v1(37.59,9.78) ; P1.0.2 7.49,11.3 25.85,11.3 Q4.0.1
  Bottom Layer w0.254: v1(31.37,9.78) v1(37.59,9.78)
L_EN: length 35.2
  Top Layer w0.254: v1(73.02,5.08) 70.79,5.08 U2.0.6 ; U1.0.14 44.82,11.96 45.82,12.95 v1(48.13,12.95)
  Bottom Layer w0.254: v1(48.13,12.95) 52.37,8.71 70.45,8.71 73.02,6.14 v1(73.02,5.08)
L_EN_IN: length 15.4
  Top Layer w0.254: P3.0.5 75.62,11.81 74.35,10.54 73.41,10.54 72.54,9.68 72.54,6.44 72.05,5.94 71.98,5.94 71.74,5.7 U2.0.5 68.88,5.7 66.74,3.56 R4.0.1
L_PH: length 35.3
  Top Layer w0.254: v1(68.58,6.48) 69.26,6.48 69.78,7 U2.0.3 ; v1(60.45,6.48) 60.45,12.83 58.8,14.48 49.02,14.48 48.26,13.72 45.86,13.72 44.32,12.18 U1.0.15
  Bottom Layer w0.254: v1(60.45,6.48) v1(68.58,6.48)
L_PH_IN: length 11.6
  Top Layer w0.254: R2.0.1 65.32,6.35 66.2,7.23 68.89,7.23 69.3,7.65 69.85,7.65 ; P3.0.1 69.47,9.65 69.47,8.03 69.85,7.65 ; U2.0.2 69.85,7.65
NSLEEP: length 56.1
  Top Layer w0.254: v1(47.12,12.19) 45.72,12.19 45.32,11.79 U1.0.13 ; U3.0.13 92.15,7.8 91.95,7.59 v1(91.95,4.7)
  Bottom Layer w0.254: v1(47.12,12.19) 47.22,12.19 48.39,11.03 48.39,10.03 53.09,5.33 62.86,5.33 65.66,2.54 89.79,2.54 v1(91.95,4.7)
R_A: length 32.2
  Top Layer w0.254: U3.0.23 88.9,11.19 88.9,12.3 90.01,13.41 91.3,13.41 93.22,11.49 93.22,10.55 95.2,8.57 99.58,8.57 100.94,9.93 Q5.0.3 ; 100.94,12.95 Q5.0.3 ; Q5.0.3 100.94,10.54 ; Q5.0.3 104.98,12.83 Q7.0.1 ; P4.0.1 110.83,14.77 Q7.0.1
R_B: length 29.7
  Top Layer w0.254: Q8.0.1 103.19,1.91 101.33,1.91 Q6.0.3 Q6.0.3 Q6.0.3 101.35,4.83 101.98,5.46 101.98,7.25 101.47,7.75 94.86,7.75 92.32,10.3 U3.0.18 ; Q8.0.1 112.19,4.11 114.05,5.97 P4.0.2
R_EN: length 22.1
  Top Layer w0.254: U3.0.14 92.25,8.3 92.96,7.58 92.96,4.32 91.82,3.18 79.25,3.18 78.02,4.4 U2.0.8
R_EN_IN: length 13.5
  Top Layer w0.254: P3.0.6 77.07,14.35 79.76,11.66 79.76,5.93 R5.0.2 78.88,5.05 U2.0.9
R_PH: length 20.5
  Top Layer w0.254: U3.0.15 92.32,8.8 93.6,7.52 v1(93.6,6.86) ; v1(78.61,6.35) U2.0.11
  Bottom Layer w0.254: v1(78.61,6.35) 79.37,7.11 93.34,7.11 v1(93.6,6.86)
R_PH_IN: length 15.2
  Top Layer w0.254: U2.0.12 78.54,7 R3.0.2 78.87,7.41 78.87,11.81 77.61,13.07 72.91,13.07 P3.0.2
$1N1646: length 21.1
  Top Layer w0.762: U1.1 4.57,36.83 3.94,37.47 2.47,37.47 2.47,37.47 2.47,38.79 4.44,40.77 4.44,42.42 6.1,44.07 10.67,44.07 11.3,44.7 12.66,44.7 R1.1
$1N1675: length 10.8
  Top Layer w0.254: R2.2 D1.A
  Top Layer w0.762: ON/OFF1.3 7.14,56.87 10.03,53.97 12.91,53.97 R2.2
$1N1680: length 10.1
  Top Layer w0.254: 12.95,46.7 10.2,46.7 9.63,47.27 ON/OFF1.1 ; 12.95,46.7 R1.2 ; 12.95,46.7 D1.K
$1N4031: length 3.1
  Top Layer w0.254: R12.2 63.71,19.69 LED3V3.A
$1N14893: length 2.1
  Top Layer w0.254: LEDCAM1.A 56.34,52.11 R13.2
$1N15943: length 14.3
  Top Layer w0.254: C10.1 20.88,31.57 21.34,32.03 U3.1 21.72,29.16 C9.1 ; 18.16,31.57 18.03,31.45
  Top Layer w0.762: C10.1 16.59,31.57 14.97,29.96 D2.K
$1N17858: length 3.1
  Top Layer w0.254: R11.2 32.77,39.84 LED5V.A
$1N22991: length 3.3
  Top Layer w0.254: LEDOP1.A 56.62,27.42 R33.2
$1N30175: length 13.6
  Top Layer w0.254: ON/OFF1.2 4.95,51.82
  Top Layer w0.762: 2.47,42.03 2.35,42.14 2.35,43.11 1.4,44.07 1.4,50.29 3.17,52.07 ON/OFF1.2
$1N38666: length 3.5
  Top Layer w0.254: U2.4 19.61,49.83 19.61,48.77
$1N39173: length 3.8
  Top Layer w0.254: U2.1 17.87,56.86 18.67,57.66 C4.1
$1N39467: length 8.5
  Top Layer w0.254: C4.2 22.48,57.66 23.24,56.9 23.24,55.37 U2.8 23.4,55.25 26.78,55.25 L1.1
$1N41387: length 8
  Top Layer w0.254: 9.78,63.37 R7.ADJ 12.36,63.37 R6.2
$1N41664: length 7
  Top Layer w0.254: R5.1 27.65,50.33 25.15,52.83 U2.6
$1N41948: length 2.1
  Top Layer w0.254: R5.2 C7.1
$1N42725: length 22.3
  Top Layer w0.254: v1(19.81,59.44) R8.1 18.96,63.37 R7.2 ; U2.5 24.04,50.8 v1(24.77,50.8)
  Bottom Layer w0.254: v1(19.81,59.44) 22.22,59.44 24.71,56.95 24.71,50.85 v1(24.77,50.8)
$1N43649: length 2.5
  Top Layer w0.254: LEDSTEER1.A 33.02,68.71 R9.1
$1N45499: length 7.8
  Top Layer w0.254: R10.1 26.16,67.82 21.59,67.82 STEER1.1
$1N56324: length 12
  Top Layer w0.254: S1.2 S1.2 117.19,56.23 118.2,57.24 R14.2 118.2,58.2 117.22,59.18 115.91,59.18 R35.1
$1N56387: length 10.7
  Top Layer w0.254: R36.1 115.91,51.05 117.09,51.05 118.33,49.82 R15.2 118.33,48.72 S2.2 S2.2
$1N56450: length 10.7
  Top Layer w0.254: S3.2 S3.2 118.45,41.48 R16.2 118.45,42.46 117.35,43.56 115.91,43.56 R37.1
$1N56513: length 10.2
  Top Layer w0.254: R38.1 115.78,36.07 117.18,36.07 R17.2 118.2,33.48 S4.2 S4.2
$1N101481: length 7.4
  Top Layer w0.254: R22.2 112.99,65.79 B1.1
$1N101720: length 9
  Top Layer w0.254: Q2.3 110.82,73.54 B1.2
$1N102266: length 4.2
  Top Layer w0.254: v1(101.99,71.24) 104.33,71.24 104.33,69.5 R23.2
$1N103802: length 9.8
  Top Layer w0.254: 35.69,71.69 36.96,71.69 v1(36.96,71.63) ; R25.1 44.49,70.36 v1(43.05,70.36)
  Bottom Layer w0.254: v1(36.96,71.63) 37.72,70.87 42.55,70.87 v1(43.05,70.36)
$1N103804: length 4.4
  Top Layer w0.254: 电机信号1.1 41.59,71.69 42.93,73.02 R26.1
$1N103886: length 12.7
  Top Layer w0.254: R27.1 44.53,67.94 v1(43.18,67.94) ; v1(37.46,64.39) 36.64,64.39 35.69,65.34 35.69,66.99
  Bottom Layer w0.254: v1(37.46,64.39) 39.37,64.39 42.93,67.94 v1(43.18,67.94)
$1N103888: length 4.8
  Top Layer w0.254: R28.1 44.74,65.53 42.93,65.53 41.47,66.99 电机信号1.2
$1N112323: length 5.7
  Top Layer w0.254: 51.69,55.37 电磁接口2.6
$1N112483: length 5.7
  Top Layer w0.254: 46.61,55.37 电磁接口2.4
$1N112563: length 5.7
  Top Layer w0.254: 44.07,55.37 电磁接口2.3
$1N112723: length 5.7
  Top Layer w0.254: 电磁接口2.1 38.99,55.37
$1N192022: length 16
  Top Layer w0.254: U1.0.7 48.07,8.15 C5.0.2 47.54,6.06 v1(47.5,6.1) 46.52,6.1 U1.0.6 ; U1.0.12 v1(47.24,10.65)
  Bottom Layer w0.254: v1(47.5,6.1) 47.5,10.39 v1(47.24,10.65)
$1N192131: length 3.3
  Top Layer w0.254: U1.0.4 44.32,5.55 45.43,4.44
$1N192135: length 2.9
  Top Layer w0.254: C1.0.2 43.82,4.54 U1.0.3
$1N192141: length 2.6
  Top Layer w0.254: C2.0.1 43.05,6.22 43.32,6.49 U1.0.2
$1N192601: length 4.1
  Top Layer w0.254: Q1.0.2 41.73,7.91 41.97,8.15
$1N192646: length 25.2
  Top Layer w0.254: 41.97,9.15 36.2,9.15 v1(36.19,9.14) ; Q3.0.2 23.75,3.94 v1(22.35,3.94)
  Bottom Layer w0.254: v1(22.35,3.94) 22.35,7.24 24.26,9.14 v1(36.19,9.14)
$1N192934: length 20.2
  Top Layer w0.254: v1(30.1,9.78) 29.84,9.53 24.96,9.53 Q4.0.2 ; 41.97,10.65 41.55,10.65 v1(40.26,11.94)
  Bottom Layer w0.254: v1(30.1,9.78) 31.11,10.79 39.12,10.79 v1(40.26,11.94)
$1N192948: length 7.3
  Top Layer w0.254: U1.0.17 43.31,11.51 43.31,12.7 41.48,14.52 Q2.0.2
$1N193539: length 2.6
  Top Layer w0.254: 50.08,2.03 LED2.0.A
$1N193933: length 2.3
  Top Layer w0.254: R6.0.2 58.13,3.75 LED1.0.A
$1N193988: length 6.6
  Top Layer w0.254: R6.0.1 57.91,7.45 S1.0.2
$1N194595: length 2.5
  Top Layer w0.254: C13.0.2 88.94,4.57 U3.0.8
$1N194600: length 10.2
  Top Layer w0.254: 87.59,7.8 U3.0.7 87.85,6.95 v1(86.87,5.97) 84.95,5.97 C12.0.2 ; v1(90.93,5.97) 90.93,6.94 U3.0.12
  Bottom Layer w0.254: v1(90.93,5.97) v1(86.87,5.97)
$1N194608: length 4.8
  Top Layer w0.254: C8.0.1 83.44,7.37 84.87,8.8 87.59,8.8
$1N194614: length 4.4
  Top Layer w0.254: C9.0.1 84.4,9.8 87.59,9.8
$1N194620: length 10.3
  Top Layer w0.254: D3.0.K 85.61,14.48 C11.0.1 85.35,12.7 C10.0.1 C9.0.2 85.6,10.3 87.59,10.3
$1N194642: length 15.5
  Top Layer w0.254: Q5.0.2 100.94,14.25 99.95,15.24 91.26,15.24 88.44,12.42 U3.0.24
$1N194645: length 20.8
  Top Layer w0.254: v1(92.08,11.81) 90.98,12.9 90.07,12.9 89.44,12.27 U3.0.22 ; v1(106.55,10.16) 106.64,10.16 107.09,9.71 Q7.0.2
  Bottom Layer w0.254: v1(92.08,11.81) 104.9,11.81 v1(106.55,10.16)
$1N194668: length 13.8
  Top Layer w0.254: U3.0.19 92.05,11.15 95.03,8.16 101.95,8.16 102.36,7.75 103.01,7.75 Q8.0.2
$1N194674: length 11.2
  Top Layer w0.254: Q6.0.2 100.94,6.97 100.56,7.35 94.7,7.35 92.25,9.8 U3.0.17
$1N194813: length 4.4
  Top Layer w0.254: U2.0.4 71.88,6.35 72.14,6.6 72.14,8 71.84,8.3 U2.0.1
$1N196227: length 4.3
  Top Layer w0.254: C8.0.2 83.76,9.3 87.59,9.3
$1N196231: length 11.2
  Top Layer w0.254: U1.0.1 40.99,7.3 C2.0.2 39.92,4.52 C4.0.1 39.84,2.11 C3.0.1 36.29,2.03

## Copper pours and planes (outline as drawn; the poured copper is in the pictures)
GND5V on Bottom Layer: -11.81,79.5 125.73,79.5 125.73,-8.76 -11.81,-8.76
GNDBAT on Top Layer: -9.53,81.41 128.02,81.41 128.02,-9.78 -9.53,-9.78

## Text on the board
Top Silkscreen Layer: LEDOP1 | 2023-5-01 | CH32V307_V5 | 浙江工商大学
